# Altium schematic sheet BATTERY_GESTION.SchDoc: DARKYDEN_BATTERY_GESTION (part 2 of 3)
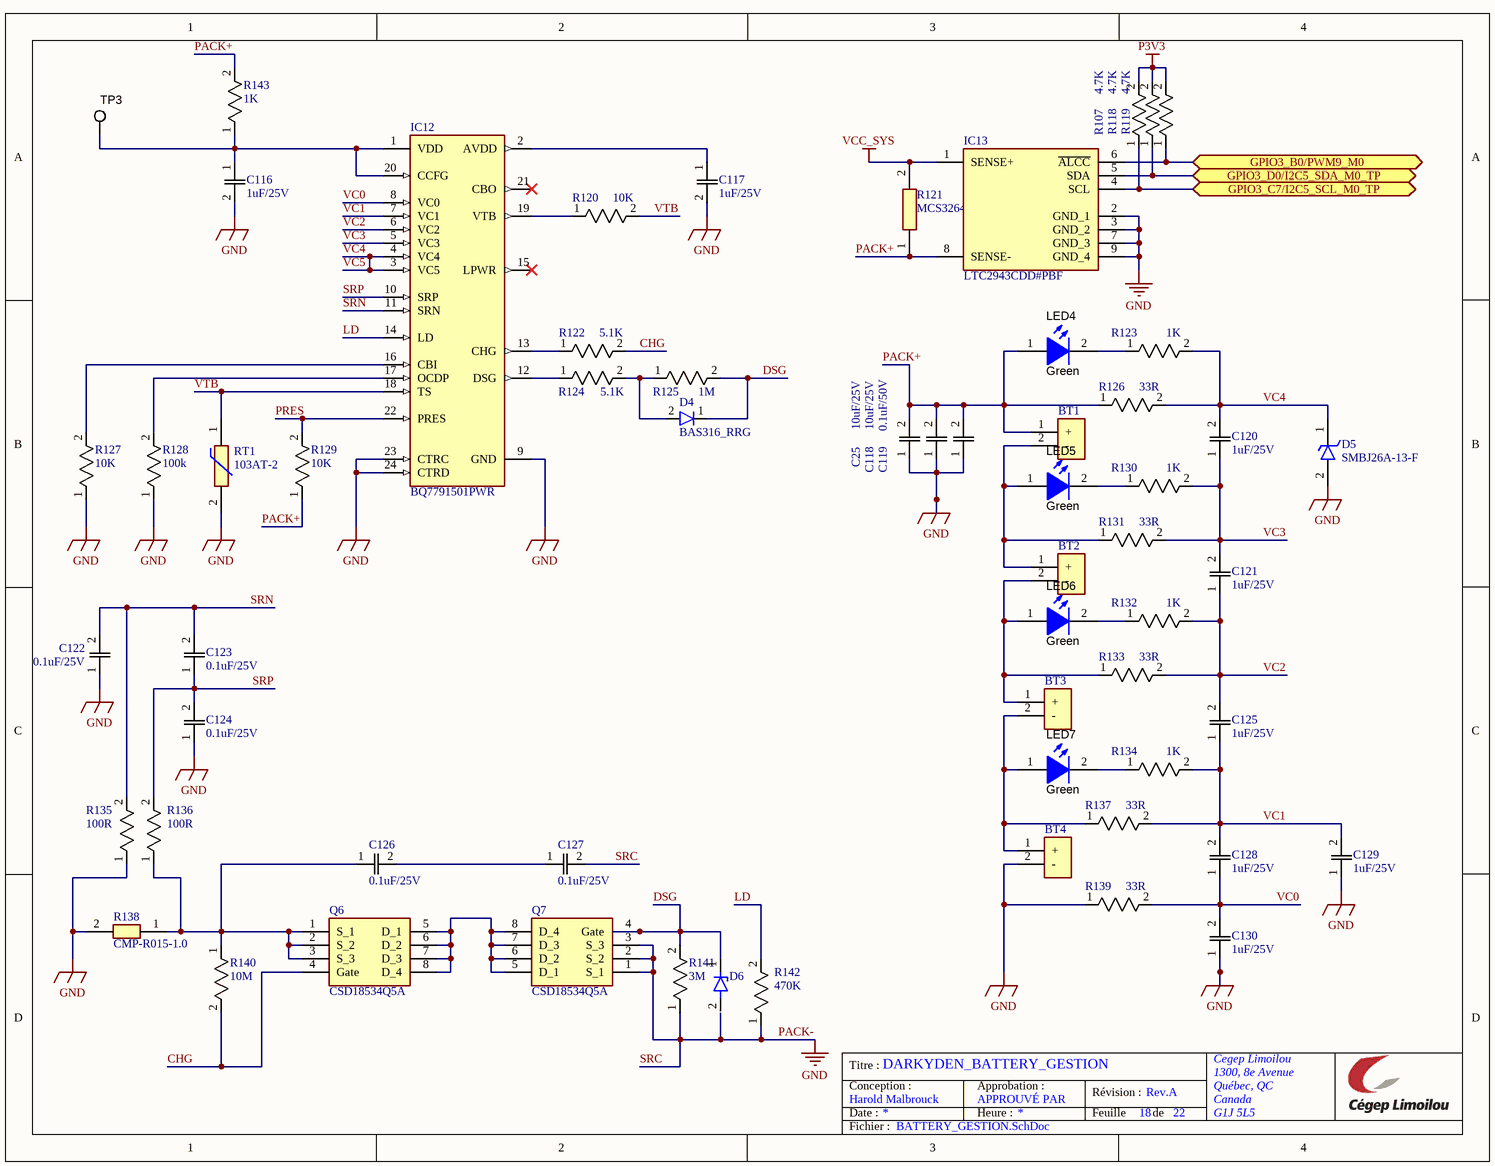
[diagram p1: BATTERY_GESTION.SchDoc]
## Library data of the parts
BT1-BT4 = Header 1.25MM: Connector; Manufacturer_Name: Molex; Datasheet Link: https://www.molex.com/pdm_docs/sd/530480210_sd.pdf; Height: 3.5mm; Manufacturer_Part_Number: 0530480210; Mouser Part Number: N/A; Mouser Price/Stock: https://www.mouser.co.uk/ProductDetail/Molex/0530480210?qs=PBcRNPEHKsoxSi7zGV6Ncw%3D%3D; Arrow Part Number: 0530480210; Arrow Price/Stock: https://www.arrow.com/en/products/0530480210/molex?utm_currency=USD&region=europe
C25 C118 = C0805C106K3PACTU: 10uF / 25 VDC, +85degC, X5R Dielec, +/-10% | KEMET C0805C106K3PACTU 0805; Dielectric Material: Ceramic; Material: 4241ConductorMaterial; Voltage Rating: 25V; Dissipation Factor: 10%; Mfr_Name: Kemet; Supplier: Digikey; Supplier Part Number: 399-11939-1-ND; Manufacturer: KEMET; Manufacturer Part Number: C0805C106K3PACTU; RoHS: Yes; Category: Ceramic Capacitors; Case/Package: 0805; Case Code (Metric): 2012; Case Code (Imperial): 0805; Min Operating Temperature: -55°C; Max Operating Temperature: 85°C; Dielectric: X5R; Packaging: Cut Tape; Voltage: 25V; Termination: Solder; Tolerance: 10%; Value: 10uF; Series: SMD Comm X5R; Voltage Rating (DC): 25V; Length: 2mm; Height: 1.25mm; Depth: 1.25mm; Reach SVHC Compliant: No; RoHS Compliant: Yes; Lead Free: 5697LeadFree; ComponentLink1URL: http://www.farnell.com/datasheets/2741185.pdf?src-supplier=Farnell; ComponentLink1Description: http://www.farnell.com/datasheets/2741185.pdf?src-supplier=Farnell; ComponentLink2URL: http://www.alliedelec.com/m/d/f3c02ddb98afa3dd1adcb801109671e9.pdf?src-supplier=Allied+Electronics; ComponentLink2Description: http://www.alliedelec.com/m/d/f3c02ddb98afa3dd1adcb801109671e9.pdf?src-supplier=Allied+Electronics; ComponentLink3URL: https://api.kemet.com/component-edge/download/datasheet/C0805C106K3PAC7800.pdf?src-supplier=Digikey; ComponentLink3Description: https://api.kemet.com/component-edge/download/datasheet/C0805C106K3PAC7800.pdf?src-supplier=Digikey; ComponentLink4URL: http://www.kemet.com/Lists/ProductCatalog/Attachments/19/KEM_C1006_X5R_SMD.pdf?src-supplier=Avnet; ComponentLink4Description: http://www.kemet.com/Lists/ProductCatalog/Attachments/19/KEM_C1006_X5R_SMD.pdf?src-supplier=Avnet; ComponentLink5URL: http://www.farnell.com/datasheets/2741185.pdf?src-supplier=Element14; ComponentLink5Description: http://www.farnell.com/datasheets/2741185.pdf?src-supplier=Element14; ComponentLink6URL: http://www.farnell.com/datasheets/2741185.pdf?src-supplier=Newark; ComponentLink6Description: http://www.farnell.com/datasheets/2741185.pdf?src-supplier=Newark; ComponentLink7URL: https://datasheet.octopart.com/C0805C106K3PACTU-Kemet-datasheet-46909776.pdf?src-supplier=Element14; ComponentLink7Description: https://datasheet.octopart.com/C0805C106K3PACTU-Kemet-datasheet-46909776.pdf?src-supplier=Element14
C116 C117 C120 C121 C125 C128-C130 = C0805C105K3RACTU: Ceramic capacitor, 1 µF, 25 V (DC), ±10 %, SMD 0805, X7R, C0805C105K3RAC7800; Manufacturer_Name: KEMET; Material: 4241ConductorMaterial; Value: 1uF; Tolerance: 10%; Voltage: 25V; Datasheet Link: https://content.kemet.com/datasheets/KEM_C1002_X7R_SMD.pdf; Height: 1.1mm; Manufacturer_Part_Number: C0805C105K3RACTU; Mouser Part Number: 80-C0805C105K3R; Mouser Price/Stock: https://www.mouser.co.uk/ProductDetail/KEMET/C0805C105K3RACTU?qs=7V%2FSUxyM1Kfm2X%2FN09twSA%3D%3D; Arrow Part Number: C0805C105K3RACTU; Arrow Price/Stock: https://www.arrow.com/en/products/c0805c105k3ractu/kemet-corporation?region=nac; Supplier: Digikey; Supplier Part Number: 399-C0805C105K3RACTUCT-ND; Manufacturer: KEMET; Manufacturer Part Number: C0805C105K3RACTU; RoHS: Yes; Category: Ceramic Capacitors; Stock: 127373; Pricing: 1=0.61, 10=0.498, 100=0.376, 1000=0.30337 (USD); Mounting Technology: Surface Mount; Case/Package: 0805; Pins: 2; Dielectric Material: Ceramic; Case Code (Imperial): 0805; Case Code (Metric): 2012; Min Operating Temperature: -55°C; Max Operating Temperature: 125°C; Dielectric: X7R; Packaging: Tape and Reel; Termination: SMD/SMT; Package Quantity: 2500; Voltage Rating: 25V; Voltage Rating (DC): 25V; Series: C; Construction: Flat; Length: 2mm; Width: 0.049inch; Depth: 1.25mm; Thickness: 0.055inch; Radiation Hardening: No; Reach SVHC Compliant: No; RoHS Compliant: Yes
C119 = C0805C104K5RACTU: 0.1uF/50V X7R 10% 0805 Multilayer Ceramic Capacitors Mlcc Smd/Smt Rohs; Manufacturer_Name: KEMET; Material: 4241ConductorMaterial; Value: 100nF; Voltage Rating: 50V; Voltage: 500V; Temperature Coefficient: 30ppm/°C; Datasheet Link: https://content.kemet.com/datasheets/KEM_C1002_X7R_SMD.pdf; Height: 1.1mm; Manufacturer_Part_Number: C0805C104K5RACTU; Mouser Part Number: 80-C0805C104K5R; Mouser Price/Stock: https://www.mouser.co.uk/ProductDetail/KEMET/C0805C104K5RACTU?qs=Pc30aiB8zWUISNb2Qeyxfw%3D%3D; Arrow Part Number: C0805C104K5RACTU; Arrow Price/Stock: https://www.arrow.com/en/products/c0805c104k5ractu/kemet-corporation?utm_currency=USD&region=nac; Supplier: Digikey; Supplier Part Number: 399-C0805C104K5RACTUCT-ND; Manufacturer: KEMET; Manufacturer Part Number: C0805C104K5RACTU; RoHS: Yes; Category: Ceramic Capacitors; Stock: 625118; Pricing: 1=0.09, 10=0.037, 100=0.0248, 1000=0.0224 (USD); Mounting Technology: Surface Mount,PCB; Case/Package: 0805; Pins: 2; Case Code (Imperial): 0805; Case Code (Metric): 2012; Min Operating Temperature: -55°C; Max Operating Temperature: 125°C; Package Quantity: 4000; Tolerance: 10%; Packaging: Tape and Reel; Voltage Rating (DC): 50V; Dielectric: X7R; Termination: SMD/SMT; Series: SMD Comm X7R; Construction: Flat; Length: 2mm; Width: 1.2mm; Lead Pitch: 0.75mm; Depth: 1.25mm; Radiation Hardening: No; Reach SVHC Compliant: No; RoHS Compliant: Yes; Lead Free: 5697LeadFree; ComponentLink1URL: https://datasheet.ciiva.com/32431/slceramic-chip-condensers-e-32431755.pdf?src-supplier=Distrelec; ComponentLink1Description: https://datasheet.ciiva.com/32431/slceramic-chip-condensers-e-32431755.pdf?src-supplier=Distrelec; ComponentLink2URL: https://datasheet.ciiva.com/28682/1851736-28682232.pdf?src-supplier=Element14; ComponentLink2Description: https://datasheet.ciiva.com/28682/1851736-28682232.pdf?src-supplier=Element14; ComponentLink3URL: https://datasheet.ciiva.com/18410/70095383-18410815.pdf?src-supplier=Allied+Electronics; ComponentLink3Description: https://datasheet.ciiva.com/18410/70095383-18410815.pdf?src-supplier=Allied+Electronics; ComponentLink4URL: https://datasheet.ciiva.com/14589/70095383-14589048.pdf?src-supplier=Allied+Electronics; ComponentLink4Description: https://datasheet.ciiva.com/14589/70095383-14589048.pdf?src-supplier=Allied+Electronics
C122-C124 C126 C127 = C0805C104K3RACTU: 0.1uF 25V X7R 10% SMD 0805 125C Plastic T/R; Mfr_Name: Kemet; Material: 4241ConductorMaterial; Value: 100nF; Temperature Coefficient: 30ppm/°C; Supplier: Digikey; Supplier Part Number: 399-C0805C104K3RACTUCT-ND; Manufacturer: KEMET; Manufacturer Part Number: C0805C104K3RACTU; RoHS: Yes; Category: Ceramic Capacitors; Mounting Technology: Surface Mount,PCB; Case/Package: 0805; Pins: 2NUMBER; Case Code (Imperial): 0805; Case Code (Metric): 2012; Min Operating Temperature: -55°C; Max Operating Temperature: 125°C; Packaging: Tape and Reel; Tolerance: 10%; Dielectric: X7R; Termination: SMD/SMT; Package Quantity: 4000; Voltage Rating: 25V; Series: SMD Comm X7R; Voltage Rating (DC): 25V; Construction: Flat; Length: 2mm; Width: 1.2mm; Height: 0.9mm; Depth: 1.25mm; Lead Pitch: 0.75mm; Thickness: 889um; Radiation Hardening: No; RoHS Compliant: Yes; Lead Free: 5697LeadFree; Reach SVHC Compliant: 4186SVHC; ComponentLink1URL: https://datasheet.ciiva.com/7842/kem-c1002-x7r-smd-7842536.pdf?src-supplier=Element14; ComponentLink1Description: https://datasheet.ciiva.com/7842/kem-c1002-x7r-smd-7842536.pdf?src-supplier=Element14; ComponentLink2URL: https://datasheet.ciiva.com/7842/kem-c1002-x7r-smd-7842538.pdf?src-supplier=Element14; ComponentLink2Description: https://datasheet.ciiva.com/7842/kem-c1002-x7r-smd-7842538.pdf?src-supplier=Element14
D4 = BAS316_RRG: Rectifier Diode Small Signal Switching 0.25A 4ns 2-Pin SOD-323 T/R; Manufacturer_Name: Taiwan Semiconductor; Manufacturer_Part_Number: BAS316 RRG; Max Reverse Voltage (DC): 100V; Average Rectified Current: 250mA; Datasheet Link: https://www.taiwansemi.com/assets/uploads/datasheet/BAS316_E1907.pdf; Height: 1.1mm; Mouser Part Number: 821-BAS316RRG; Mouser Price/Stock: https://www.mouser.co.uk/ProductDetail/Taiwan-Semiconductor/BAS316-RRG?qs=KwaGCOX4wIaA8PMRTc7F4Q%3D%3D; Arrow Part Number: BAS316 RRG; Arrow Price/Stock: https://www.arrow.com/en/products/bas316rrg/taiwan-semiconductor?region=europe; Supplier: Digikey; Supplier Part Number: BAS316RRGCT-ND; Manufacturer: Taiwan Semiconductor; Manufacturer Part Number: BAS316 RRG; RoHS: Yes; Category: Diodes; Stock: 41621; Pricing: 1=0.11, 10=0.081, 100=0.0564, 500=0.04008, 1000=0.03198 (USD); Mounting Technology: Surface Mount; Series: -; Packaging: Cut Tape; Reverse Recovery Time: 4ns; RoHS Compliant: Yes; ComponentLink1URL: https://www.taiwansemi.com/assets/uploads/datasheet/BAS316_E1907.pdf?src-supplier=Digikey; ComponentLink1Description: https://www.taiwansemi.com/assets/uploads/datasheet/BAS316_E1907.pdf?src-supplier=Digikey; ComponentLink2URL: https://datasheet.octopart.com/BAS316-RRG-Taiwan-Semiconductor-datasheet-166558704.pdf?src-supplier=Future+Electronics; ComponentLink2Description: https://datasheet.octopart.com/BAS316-RRG-Taiwan-Semiconductor-datasheet-166558704.pdf?src-supplier=Future+Electronics
D5 = SMBJ26A-13-F: TVS DIODE 26VWM 42.1VC SMB; Manufacturer_Name: Diodes Incorporated; Datasheet Link: https://www.diodes.com/assets/Datasheets/ds19002.pdf; Height: 2.5mm; Manufacturer_Part_Number: SMBJ26A-13-F; Mouser Part Number: 621-SMBJ26A-13-F; Mouser Price/Stock: https://www.mouser.co.uk/ProductDetail/Diodes-Incorporated/SMBJ26A-13-F?qs=gaDBXWSqsDCR7oWfjun1vA%3D%3D; Arrow Part Number: SMBJ26A-13-F; Arrow Price/Stock: https://www.arrow.com/en/products/smbj26a-13-f/diodes-incorporated?region=nac
D6 = MMSZ5248B-7-F: Zener Diode 18 V 500 mW ±5% Surface Mount SOD-123; Manufacturer_Name: Multicomp Pro; Datasheet Link: https://componentsearchengine.com/Datasheets/2/MMSZ5248B-7-F.pdf; Height: 1.15mm; Manufacturer_Part_Number: MMSZ5248B-7-F
IC12 = BQ7791501PWR: /Polymer 3~5 TSSOP-24 Battery Management ICs ROHS; Manufacturer_Name: Texas Instruments; Fault Protection: Over Current,Over Temperature,Short Circuit,Over/Under Voltage; Max Supply Voltage: 25V; Min Supply Voltage: 3V; Number of Cells: 5; Number of Outputs: 1; Output Voltage: 16V; Datasheet Link: https://www.ti.com/lit/gpn/BQ77915; Height: 1.2mm; Manufacturer_Part_Number: BQ7791501PWR; Mouser Part Number: 595-BQ7791501PWR; Mouser Price/Stock: https://www.mouser.co.uk/ProductDetail/Texas-Instruments/BQ7791501PWR?qs=B6kkDfuK7%2FBYqAWOM%2FFUaQ%3D%3D; Arrow Part Number: BQ7791501PWR; Arrow Price/Stock: null?region=nac; Supplier: Digikey; Supplier Part Number: 296-BQ7791501PWRCT-ND; Manufacturer: Texas Instruments; Manufacturer Part Number: BQ7791501PWR; RoHS: Yes; Category: Battery Management; Stock: 5538; Pricing: 1=1.62, 10=1.183, 25=1.0748, 100=0.9555, 250=0.89868, 500=0.86442, 1000=0.83623 (USD); Mounting Technology: Surface Mount; Case/Package: TSSOP; Pins: 24; Min Operating Temperature: -40°C; Max Operating Temperature: 85°C; Series: -; Length: 7.8mm; Width: 4.4mm; Thickness: 1mm; ComponentLink1URL: http://www.ti.com/general/docs/suppproductinfo.tsp?distId=10&amp;gotoUrl=http%3A%2F%2Fwww.ti.com%2Flit%2Fgpn%2Fbq77915&src-supplier=Digikey; ComponentLink1Description: http://www.ti.com/general/docs/suppproductinfo.tsp?distId=10&amp;gotoUrl=http%3A%2F%2Fwww.ti.com%2Flit%2Fgpn%2Fbq77915&src-supplier=Digikey
IC13 = LTC2943CDD#PBF: LTC2943 - Multicell Battery Gas Gauge with Temperature, Voltage and Current Measurement; Manufacturer_Name: Analog Devices; Manufacturer: Analog Devices / Linear Technology; Min Supply Voltage: 3.6V; Max Supply Voltage: 20V; Interface: I2C,SMBus; Battery Type: UNIVERSAL; Nominal Supply Current: 650uA; Datasheet Link: https://www.analog.com/media/en/technical-documentation/data-sheets/2943fa.pdf; Height: 0.8mm; Manufacturer_Part_Number: LTC2943CDD#PBF; Mouser Part Number: 584-LTC2943CDD#PBF; Mouser Price/Stock: https://www.mouser.co.uk/ProductDetail/Analog-Devices/LTC2943CDDPBF?qs=hVkxg5c3xu%2FXIG8gAJxzFw%3D%3D; Arrow Part Number: LTC2943CDD#PBF; Arrow Price/Stock: https://www.arrow.com/en/products/ltc2943cddpbf/analog-devices?utm_currency=USD&region=nac; Supplier: Digikey; Supplier Part Number: 505-LTC2943CDD#PBF-ND; Manufacturer Part Number: LTC2943CDD#PBF; RoHS: Yes; Category: Battery Management; Stock: 11003; Pricing: 1=7.04, 10=4.723, 25=4.1192, 121=3.55 (USD); Mounting Technology: Surface Mount; Case/Package: DFN; Pins: 8; Min Operating Temperature: 0°C; Max Operating Temperature: 70°C; Packaging: Rail/Tube; Series: -; Reach SVHC Compliant: No; RoHS Compliant: Yes; ComponentLink1URL: https://datasheet.ciiva.com/28383/1831515-28383394.pdf?src-supplier=Element14; ComponentLink1Description: https://datasheet.ciiva.com/28383/1831515-28383394.pdf?src-supplier=Element14; ComponentLink2URL: https://datasheet.ciiva.com/23944/1765916-23944624.pdf?src-supplier=Newark; ComponentLink2Description: https://datasheet.ciiva.com/23944/1765916-23944624.pdf?src-supplier=Newark; ComponentLink3URL: https://datasheet.ciiva.com/29610/44018-29610085.pdf?src-supplier=Digikey; ComponentLink3Description: https://datasheet.ciiva.com/29610/44018-29610085.pdf?src-supplier=Digikey; ComponentLink4URL: https://datasheet.ciiva.com/31395/1831515-31395594.pdf?src-supplier=Farnell; ComponentLink4Description: https://datasheet.ciiva.com/31395/1831515-31395594.pdf?src-supplier=Farnell
LED4-LED7 = LED_Gr_SMD: LED, Green, SMD; Manufacturer: Lite-On; Vf_V: 2.1V; Io_A: 20mA; Power_TotalModule: 100mW; Value1: 0.1W; CompType: LED; PartNumber: LTST-C190GKT; MountType: SMT; RoHS: Y; PackageReference: 1.6x0.8x0.8mm; Type: ?; Value2: 2.1V; Color: green; ComponentLink1URL: https://sps06.itg.ti.com/sites/KMS/crossdivteams/altium/docs/ComponentDatasheets/LTST-C190GKT.pdf; ComponentLink1Description: Datasheet link
Q6 Q7 = CSD18534Q5A: MOSFET N-Channel 60 V 13A (Ta), 50A (Tc) 3.1W (Ta), 77W (Tc) Surface Mount 8-VSONP (5x6); Manufacturer_Name: Texas Instruments; Datasheet Link: http://www.ti.com/lit/gpn/csd18534q5a; Manufacturer_Part_Number: CSD18534Q5A; Mouser Part Number: 595-CSD18534Q5A; Mouser Price/Stock: https://www.mouser.co.uk/ProductDetail/Texas-Instruments/CSD18534Q5A?qs=9Zb5cNRUa0ZPNHf4ZXtqIA%3D%3D; Arrow Part Number: CSD18534Q5A; Arrow Price/Stock: https://www.arrow.com/en/products/csd18534q5a/texas-instruments?utm_currency=USD&region=nac
R107 R118 R119 = ERA-3AEB472V: Res Thin Film 0603 4.7K Ohm 0.1% 0.1W ±25ppm/°C Molded SMD Punched Carrier T/R; Mfr_Name: Panasonic; Voltage Rating: 75V; Value: 4.7kR; Power Rating: 100mW; Supplier: Digikey; Supplier Part Number: P4.7KDBCT-ND; Manufacturer: Panasonic; Manufacturer Part Number: ERA-3AEB472V; RoHS: Yes; Category: Chip SMD Resistors; Stock: 284751; Pricing: 1=0.1, 10=0.065, 50=0.0574, 100=0.0541, 500=0.0475, 1000=0.045 (USD); Mounting Technology: Surface Mount; Case/Package: 0603; Pins: 2; Contact Plating: Tin; Case Code (Metric): 1608; Case Code (Imperial): 0603; Min Operating Temperature: -55°C; Max Operating Temperature: 155°C; Packaging: Tape and Reel; Package Quantity: 5000; Termination: SMD/SMT; Series: ERA-3A; Tolerance: 0.1%; Resistor Type: Thin Film; Number of Terminations: 2; Temperature Coefficient: 25ppm/°C; Max Power Dissipation: 100mW; Voltage Rating (DC): 75V; Working Voltage: 75V; Construction: Rectangular; Resistance Tolerance: 0.1%; Technology: THIN FILM; Features: Automotive AEC-Q200; Length: 1.6mm; Width: 0.8mm; Height: 0.45mm; Depth: 0.8mm; Ratings: AEC-Q200; Radiation Hardening: No; Reach SVHC Compliant: No; RoHS Compliant: Yes; Military Standard: Not; Lead Free: Lead Free; ComponentLink1URL: https://datasheet.ciiva.com/11808/0900766b80fe20f7-11808039.pdf?src-supplier=Rs; ComponentLink1Description: https://datasheet.ciiva.com/11808/0900766b80fe20f7-11808039.pdf?src-supplier=Rs; ComponentLink2URL: https://datasheet.ciiva.com/29183/451124-da-01-en-widerstand-0603-era-29183789.pdf?src-supplier=Conrad; ComponentLink2Description: https://datasheet.ciiva.com/29183/451124-da-01-en-widerstand-0603-era-29183789.pdf?src-supplier=Conrad; ComponentLink3URL: https://datasheet.ciiva.com/22781/485442-22781497.pdf?src-supplier=Farnell; ComponentLink3Description: https://datasheet.ciiva.com/22781/485442-22781497.pdf?src-supplier=Farnell; ComponentLink4URL: https://datasheet.ciiva.com/43455/485442-43455227.pdf?src-supplier=Farnell; ComponentLink4Description: https://datasheet.ciiva.com/43455/485442-43455227.pdf?src-supplier=Farnell; ComponentLink5URL: https://datasheet.ciiva.com/9116/aoa0000ce26-9116681.pdf?src-supplier=Avnet; ComponentLink5Description: https://datasheet.ciiva.com/9116/aoa0000ce26-9116681.pdf?src-supplier=Avnet; ComponentLink6URL: https://datasheet.ciiva.com/9117/aoa0000ce26-9117707.pdf?src-supplier=Avnet; ComponentLink6Description: https://datasheet.ciiva.com/9117/aoa0000ce26-9117707.pdf?src-supplier=Avnet; ComponentLink7URL: https://datasheet.ciiva.com/48425/era-eng-tds-48425470.pdf?src-supplier=Distrelec; ComponentLink7Description: https://datasheet.ciiva.com/48425/era-eng-tds-48425470.pdf?src-supplier=Distrelec; ComponentLink8URL: https://datasheet.ciiva.com/46422/485442-46422693.pdf?src-supplier=Element14; ComponentLink8Description: https://datasheet.ciiva.com/46422/485442-46422693.pdf?src-supplier=Element14; ComponentLink9URL: https://datasheet.ciiva.com/30078/54aoa0000ce26-30078815.pdf?src-supplier=Onlinecomponents.com; ComponentLink9Description: https://datasheet.ciiva.com/30078/54aoa0000ce26-30078815.pdf?src-supplier=Onlinecomponents.com; ComponentLink10URL: https://datasheet.ciiva.com/22743/485442-22743061.pdf?src-supplier=Element14; ComponentLink10Description: https://datasheet.ciiva.com/22743/485442-22743061.pdf?src-supplier=Element14
R120 R127 R129 = ERJ-3GEYJ103V: 10K Ohm 5% Res Thick Film 0603  0.1W(1/10W) ±200ppm/C Pad SMD Automotive T/R; Manufacturer_Name: Panasonic; Value: 10kR; Temperature Coefficient: 200ppm/°C; Power Rating: 100mW; Voltage Rating: 75V; Datasheet Link: http://docs-europe.electrocomponents.com/webdocs/13ba/0900766b813ba21b.pdf; Height: 0.55mm; Manufacturer_Part_Number: ERJ-3GEYJ103V; Mouser Part Number: 667-ERJ-3GEYJ103V; Mouser Price/Stock: https://www.mouser.co.uk/ProductDetail/Panasonic/ERJ-3GEYJ103V?qs=66DK8nO8gJBWgc%252B0VNNxzg%3D%3D; Arrow Part Number: ERJ-3GEYJ103V; Arrow Price/Stock: https://www.arrow.com/en/products/erj-3geyj103v/panasonic?region=europe; Supplier: Digikey; Supplier Part Number: P10KGCT-ND; Manufacturer: Panasonic; Manufacturer Part Number: ERJ-3GEYJ103V; RoHS: Yes; Category: Chip SMD Resistors; Stock: 2191587; Pricing: 1=0.1, 10=0.033, 50=0.02, 100=0.0165, 500=0.01096, 1000=0.00939 (USD); Mounting Technology: Surface Mount; Case/Package: 0603; Case Code (Imperial): 0603; Case Code (Metric): 1608; Weight: 7.1E-05oz; Contact Plating: Tin; Min Operating Temperature: -55°C; Max Operating Temperature: 155°C; Tolerance: 5%; Packaging: Tape and Reel; Technology: THICK FILM; Package Quantity: 1; Resistor Type: Thick Film; Termination: SMD/SMT; Number of Terminations: 2; Max Power Dissipation: 100mW; Working Voltage: 75V; Features: Automotive AEC-Q200; Series: ERJ; Construction: Rectangular; Resistance Tolerance: 5%; Length: 1.6mm; Width: 0.8mm; Depth: 0.8mm; Reach SVHC Compliant: No; Military Standard: Not; Lead Free: Lead Free; RoHS Compliant: Yes; ComponentLink1URL: https://datasheet.ciiva.com/11809/0900766b80f806dd-11809566.pdf?src-supplier=Rs; ComponentLink1Description: https://datasheet.ciiva.com/11809/0900766b80f806dd-11809566.pdf?src-supplier=Rs; ComponentLink2URL: https://datasheet.ciiva.com/34303/2007265-34303757.pdf?src-supplier=Jameco; ComponentLink2Description: https://datasheet.ciiva.com/34303/2007265-34303757.pdf?src-supplier=Jameco; ComponentLink3URL: https://datasheet.ciiva.com/48531/aoa0000ce1-48531887.pdf?src-supplier=Avnet; ComponentLink3Description: https://datasheet.ciiva.com/48531/aoa0000ce1-48531887.pdf?src-supplier=Avnet; ComponentLink4URL: https://datasheet.ciiva.com/9117/aoa0000ce1-9117038.pdf?src-supplier=Avnet; ComponentLink4Description: https://datasheet.ciiva.com/9117/aoa0000ce1-9117038.pdf?src-supplier=Avnet; ComponentLink5URL: https://datasheet.ciiva.com/28514/1678796-28514213.pdf?src-supplier=Element14; ComponentLink5Description: https://datasheet.ciiva.com/28514/1678796-28514213.pdf?src-supplier=Element14; ComponentLink6URL: https://datasheet.ciiva.com/46371/1678796-46371909.pdf?src-supplier=Element14; ComponentLink6Description: https://datasheet.ciiva.com/46371/1678796-46371909.pdf?src-supplier=Element14; ComponentLink7URL: https://datasheet.ciiva.com/46385/1678796-46385240.pdf?src-supplier=Element14; ComponentLink7Description: https://datasheet.ciiva.com/46385/1678796-46385240.pdf?src-supplier=Element14; ComponentLink8URL: https://datasheet.ciiva.com/24133/aoa0000ce1-37422-24133064.pdf?src-supplier=Mouser; ComponentLink8Description: https://datasheet.ciiva.com/24133/aoa0000ce1-37422-24133064.pdf?src-supplier=Mouser; ComponentLink9URL: https://datasheet.ciiva.com/16740/aoa0000ce1-16740655.pdf?src-supplier=Future+Electronics; ComponentLink9Description: https://datasheet.ciiva.com/16740/aoa0000ce1-16740655.pdf?src-supplier=Future+Electronics; ComponentLink10URL: https://datasheet.ciiva.com/30147/4aoa0000ce1-30147029.pdf?src-supplier=Onlinecomponents.com; ComponentLink10Description: https://datasheet.ciiva.com/30147/4aoa0000ce1-30147029.pdf?src-supplier=Onlinecomponents.com
R121 = MCS3264R010FER: Res Metal Alloy 2512 0.01 Ohm 1% 2W 50ppm/ C Molded SMD T/R; Manufacturer_Name: Ohmite; Value: 10mR; Voltage Rating: 220mV; Temperature Coefficient: 50ppm/°C; Datasheet Link: https://componentsearchengine.com/Datasheets/2/MCS3264R010FER.pdf; Height: 0.62mm; Manufacturer_Part_Number: MCS3264R010FER; Mouser Part Number: 588-MCS3264R010FER; Mouser Price/Stock: https://www.mouser.co.uk/ProductDetail/Ohmite/MCS3264R010FER?qs=SvApV4JM6f2MfSPuOPYXkg%3D%3D; Supplier: Digikey; Supplier Part Number: MCS3264R010FERCT-ND; Manufacturer: Ohmite; Manufacturer Part Number: MCS3264R010FER; RoHS: Yes; Category: Chip SMD Resistors; Stock: 27552; Pricing: 1=0.83, 10=0.538, 25=0.4588, 50=0.4092, 100=0.367, 250=0.32076, 500=0.29178, 1000=0.26717 (USD); Mounting Technology: Surface Mount; Case/Package: 2512; Pins: 2; Case Code (Metric): 3264; Case Code (Imperial): 1225; Min Operating Temperature: -25°C; Max Operating Temperature: 150°C; Package Quantity: 1; Power Rating: 2W; Tolerance: 1%; Packaging: Tape and Reel; Resistor Type: Metal Film,Metal Alloy; Number of Terminations: 2; Termination: SMD/SMT; Max Power Dissipation: 2W; Features: Flame Retardant Coating; Series: MCS; Resistance Tolerance: 1%; Technology: METAL ALLOY; Construction: Rectangular; Length: 6.4mm; Width: 3.2mm; Depth: 3.2mm; Military Standard: Not; RoHS Compliant: Yes; Reach SVHC Compliant: Unknown; ComponentLink1URL: https://datasheet.ciiva.com/2482/res-mcs-2482064.pdf?src-supplier=Digikey; ComponentLink1Description: https://datasheet.ciiva.com/2482/res-mcs-2482064.pdf?src-supplier=Digikey; ComponentLink2URL: https://datasheet.ciiva.com/2482/res-mcs-2482065.pdf?src-supplier=Digikey; ComponentLink2Description: https://datasheet.ciiva.com/2482/res-mcs-2482065.pdf?src-supplier=Digikey; ComponentLink3URL: https://datasheet.ciiva.com/2482/res-mcs-2482063.pdf?src-supplier=Digikey; ComponentLink3Description: https://datasheet.ciiva.com/2482/res-mcs-2482063.pdf?src-supplier=Digikey; ComponentLink4URL: https://datasheet.ciiva.com/46391/1807944-46391575.pdf?src-supplier=Element14; ComponentLink4Description: https://datasheet.ciiva.com/46391/1807944-46391575.pdf?src-supplier=Element14; ComponentLink5URL: https://datasheet.ciiva.com/7715/mcs-7715862.pdf?src-supplier=Element14; ComponentLink5Description: https://datasheet.ciiva.com/7715/mcs-7715862.pdf?src-supplier=Element14; ComponentLink6URL: https://datasheet.ciiva.com/5970/mcs-5970876.pdf?src-supplier=Farnell; ComponentLink6Description: https://datasheet.ciiva.com/5970/mcs-5970876.pdf?src-supplier=Farnell; ComponentLink7URL: https://datasheet.ciiva.com/5468/mcs-14321-5468876.pdf?src-supplier=Mouser; ComponentLink7Description: https://datasheet.ciiva.com/5468/mcs-14321-5468876.pdf?src-supplier=Mouser; ComponentLink8URL: https://datasheet.ciiva.com/28655/1842857-28655687.pdf?src-supplier=Element14; ComponentLink8Description: https://datasheet.ciiva.com/28655/1842857-28655687.pdf?src-supplier=Element14; ComponentLink9URL: https://datasheet.ciiva.com/16786/70024315-16786781.pdf?src-supplier=Allied+Electronics; ComponentLink9Description: https://datasheet.ciiva.com/16786/70024315-16786781.pdf?src-supplier=Allied+Electronics
R122 R124 = ERA-3ARW512V: 5.1K Ohm 0.05% 0.1W ±10ppm/°C Molded Res Thin Film 0603 SMD Punched Carrier T/R; Manufacturer_Name: Panasonic; Value: 5.1kR; Power Rating: 100mW; Voltage Rating: 75V; Datasheet Link: https://industrial.panasonic.com/cdbs/www-data/pdf/RDM0000/AOA0000C307.pdf; Height: 0.55mm; Manufacturer_Part_Number: ERA-3ARW512V; Mouser Part Number: 667-ERA-3ARW512V; Mouser Price/Stock: https://www.mouser.co.uk/ProductDetail/Panasonic/ERA-3ARW512V?qs=ob%252BdNz2%252BYEinU%2F%252BGAvZ4EA%3D%3D; Supplier: Digikey; Supplier Part Number: P5.1KBECT-ND; Manufacturer: Panasonic; Manufacturer Part Number: ERA-3ARW512V; RoHS: Yes; Category: Chip SMD Resistors; Stock: 12588; Pricing: 1=0.47, 10=0.394, 50=0.345, 100=0.3263, 500=0.28562, 1000=0.2461 (USD); Mounting Technology: Surface Mount; Case/Package: 0603; Case Code (Metric): 1608; Case Code (Imperial): 0603; Weight: 7.1E-05oz; Contact Plating: Tin; Min Operating Temperature: -55°C; Max Operating Temperature: 155°C; Tolerance: 0.05%; Packaging: Tape and Reel; Package Quantity: 1; Number of Terminations: 2; Termination: SMD/SMT; Temperature Coefficient: 10ppm/°C; Max Power Dissipation: 100mW; Features: Automotive AEC-Q200; Series: ERA-3A; Technology: METAL FILM; Voltage Rating (DC): 75V; Length: 1.6mm; Width: 0.8mm; Depth: 0.8mm; Lead Free: Lead Free; RoHS Compliant: Yes; ComponentLink1URL: https://media.digikey.com/pdf/Data%20Sheets/Panasonic%20Resistors%20Thermistors%20PDFs/ERA_Series_LE.pdf?src-supplier=Digikey; ComponentLink1Description: https://media.digikey.com/pdf/Data%20Sheets/Panasonic%20Resistors%20Thermistors%20PDFs/ERA_Series_LE.pdf?src-supplier=Digikey; ComponentLink2URL: http://www.onlinecomponents.com/datasheet/era-3arw512v.aspx?p=44480300&src-supplier=Onlinecomponents.com; ComponentLink2Description: http://www.onlinecomponents.com/datasheet/era-3arw512v.aspx?p=44480300&src-supplier=Onlinecomponents.com; ComponentLink3URL: http://www.alliedelec.com/m/d/b6b0537e86f421aa7f5975bb1d8f429a.pdf?src-supplier=Allied+Electronics; ComponentLink3Description: http://www.alliedelec.com/m/d/b6b0537e86f421aa7f5975bb1d8f429a.pdf?src-supplier=Allied+Electronics; ComponentLink4URL: http://uk.rs-online.com/webdocs/1440/0900766b814408ab.pdf?src-supplier=Rs; ComponentLink4Description: http://uk.rs-online.com/webdocs/1440/0900766b814408ab.pdf?src-supplier=Rs; ComponentLink5URL: http://www.mouser.com/ds/2/315/AOA0000C237-944224.pdf?src-supplier=Mouser; ComponentLink5Description: http://www.mouser.com/ds/2/315/AOA0000C237-944224.pdf?src-supplier=Mouser; ComponentLink6URL: https://industrial.panasonic.com/cdbs/www-data/pdf/RDM0000/AOA0000C307.pdf?src-supplier=Digikey; ComponentLink6Description: https://industrial.panasonic.com/cdbs/www-data/pdf/RDM0000/AOA0000C307.pdf?src-supplier=Digikey; ComponentLink7URL: http://industrial.panasonic.com/www-data/pdf/AOA0000/AOA0000CE26.pdf?src-supplier=Avnet; ComponentLink7Description: http://industrial.panasonic.com/www-data/pdf/AOA0000/AOA0000CE26.pdf?src-supplier=Avnet; ComponentLink8URL: https://datasheet.octopart.com/ERA-3ARW512V-Panasonic-datasheet-33006989.pdf?src-supplier=Electro+Sonic; ComponentLink8Description: https://datasheet.octopart.com/ERA-3ARW512V-Panasonic-datasheet-33006989.pdf?src-supplier=Electro+Sonic; ComponentLink9URL: https://datasheet.octopart.com/ERA-3ARW512V-Panasonic-datasheet-154766165.pdf?src-supplier=Master+Electronics; ComponentLink9Description: https://datasheet.octopart.com/ERA-3ARW512V-Panasonic-datasheet-154766165.pdf?src-supplier=Master+Electronics
R123 R130 R132 R134 R143 = ERJ-3EKF1001V: 1K Ohm 1% 1/10W Res Thick Film 0603 ±100ppm/°C Molded SMD Punched Carrier T/R; Manufacturer_Name: Panasonic; Value: 1kR; Power Rating: 100mW; Voltage Rating: 75V; Datasheet Link: http://industrial.panasonic.com/cdbs/www-data/pdf/RDA0000/AOA0000C86.pdf; Height: 0.55mm; Manufacturer_Part_Number: ERJ-3EKF1001V; Mouser Part Number: 667-ERJ-3EKF1001V; Mouser Price/Stock: https://www.mouser.co.uk/ProductDetail/Panasonic/ERJ-3EKF1001V?qs=H7k1u0Mp9JTM8yQxOuvoDg%3D%3D; Arrow Part Number: ERJ-3EKF1001V; Arrow Price/Stock: https://www.arrow.com/en/products/erj-3ekf1001v/panasonic?utm_currency=USD&region=europe; Supplier: Digikey; Supplier Part Number: P1.00KHCT-ND; Manufacturer: Panasonic; Manufacturer Part Number: ERJ-3EKF1001V; RoHS: Yes; Category: Chip SMD Resistors; Stock: 1610348; Pricing: 1=0.1, 10=0.035, 100=0.0177, 1000=0.01014, 2500=0.00847 (USD); Mounting Technology: Surface Mount; Case/Package: 0603; Pins: 2; Case Code (Metric): 1608; Case Code (Imperial): 0603; Contact Plating: Tin; Min Operating Temperature: -55°C; Max Operating Temperature: 155°C; Tolerance: 1%; Temperature Coefficient: 100ppm/°C; Packaging: Tape and Reel; Package Quantity: 5000; Resistor Type: Thick Film; Number of Terminations: 2; Termination: SMD/SMT; Max Power Dissipation: 100mW; Voltage Rating (DC): 75V; Features: Automotive AEC-Q200; Series: ERJ; Technology: THICK FILM; Construction: Rectangular; Resistance Tolerance: 1%; Length: 1.6mm; Width: 0.8mm; Depth: 0.8mm; Radiation Hardening: No; Reach SVHC Compliant: No; Military Standard: Not; RoHS Compliant: Yes; ComponentLink1URL: https://datasheet.ciiva.com/48530/aoa0000ce2-48530987.pdf?src-supplier=Avnet; ComponentLink1Description: https://datasheet.ciiva.com/48530/aoa0000ce2-48530987.pdf?src-supplier=Avnet; ComponentLink2URL: https://datasheet.ciiva.com/30063/aoa0000ce2-30063390.pdf?src-supplier=Onlinecomponents.com; ComponentLink2Description: https://datasheet.ciiva.com/30063/aoa0000ce2-30063390.pdf?src-supplier=Onlinecomponents.com; ComponentLink3URL: https://datasheet.ciiva.com/16449/aoa0000ce2-16449065.pdf?src-supplier=Future+Electronics; ComponentLink3Description: https://datasheet.ciiva.com/16449/aoa0000ce2-16449065.pdf?src-supplier=Future+Electronics; ComponentLink4URL: https://datasheet.ciiva.com/22673/1678782-22673918.pdf?src-supplier=Element14; ComponentLink4Description: https://datasheet.ciiva.com/22673/1678782-22673918.pdf?src-supplier=Element14; ComponentLink5URL: https://datasheet.ciiva.com/16768/70260748-16768437.pdf?src-supplier=Allied+Electronics; ComponentLink5Description: https://datasheet.ciiva.com/16768/70260748-16768437.pdf?src-supplier=Allied+Electronics; ComponentLink6URL: https://datasheet.ciiva.com/16774/70260748-16774550.pdf?src-supplier=Allied+Electronics; ComponentLink6Description: https://datasheet.ciiva.com/16774/70260748-16774550.pdf?src-supplier=Allied+Electronics; ComponentLink7URL: https://datasheet.ciiva.com/46373/1678782-46373339.pdf?src-supplier=Element14; ComponentLink7Description: https://datasheet.ciiva.com/46373/1678782-46373339.pdf?src-supplier=Element14; ComponentLink8URL: https://datasheet.ciiva.com/46373/1678782-46373340.pdf?src-supplier=Element14; ComponentLink8Description: https://datasheet.ciiva.com/46373/1678782-46373340.pdf?src-supplier=Element14; ComponentLink9URL: https://datasheet.ciiva.com/7942/aoa0000ce2-7942427.pdf?src-supplier=Element14; ComponentLink9Description: https://datasheet.ciiva.com/7942/aoa0000ce2-7942427.pdf?src-supplier=Element14; ComponentLink10URL: https://datasheet.ciiva.com/9198/aoa0000ce2-9198923.pdf?src-supplier=Avnet; ComponentLink10Description: https://datasheet.ciiva.com/9198/aoa0000ce2-9198923.pdf?src-supplier=Avnet; ComponentLink11URL: https://datasheet.ciiva.com/24070/aoa0000ce2-24070269.pdf?src-supplier=Mouser; ComponentLink11Description: https://datasheet.ciiva.com/24070/aoa0000ce2-24070269.pdf?src-supplier=Mouser
R125 = ERJ-3GEYJ105V: 1M Ohm Res Thick Film 0603 5% 0.1W(1/10W) +/-200ppm/ßC SMD Automotive T/R; Manufacturer_Name: Panasonic; Value: 1MR; Power Rating: 100mW; Voltage Rating: 75V; Temperature Coefficient: 200ppm/°C; Datasheet Link: http://docs-europe.electrocomponents.com/webdocs/13ba/0900766b813ba21b.pdf; Height: 0.55mm; Manufacturer_Part_Number: ERJ-3GEYJ105V; Mouser Part Number: 667-ERJ-3GEYJ105V; Mouser Price/Stock: https://www.mouser.co.uk/ProductDetail/Panasonic/ERJ-3GEYJ105V?qs=66DK8nO8gJAFuT6JGu2rQw%3D%3D; Arrow Part Number: ERJ-3GEYJ105V; Arrow Price/Stock: https://www.arrow.com/en/products/erj-3geyj105v/panasonic?region=nac; Supplier: Digikey; Supplier Part Number: P1.0MGCT-ND; Manufacturer: Panasonic; Manufacturer Part Number: ERJ-3GEYJ105V; RoHS: Yes; Category: Chip SMD Resistors; Stock: 339054; Pricing: 1=0.1, 10=0.033, 50=0.02, 100=0.0165, 500=0.01096, 1000=0.00939 (USD); Mounting Technology: Surface Mount; Case/Package: 0603; Case Code (Imperial): 0603; Case Code (Metric): 1608; Weight: 7.1E-05oz; Contact Plating: Tin; Min Operating Temperature: -55°C; Max Operating Temperature: 155°C; Packaging: Tape and Reel; Tolerance: 5%; Package Quantity: 1; Resistor Type: Thick Film; Termination: SMD/SMT; Number of Terminations: 2; Max Power Dissipation: 100mW; Features: Automotive AEC-Q200; Series: ERJ; Resistance Tolerance: 5%; Construction: Rectangular; Technology: THICK FILM; Length: 1.6mm; Width: 0.8mm; Depth: 0.8mm; Radiation Hardening: No; Military Standard: Not; Lead Free: Lead Free; RoHS Compliant: Yes; Reach SVHC Compliant: Unknown; ComponentLink1URL: https://datasheet.ciiva.com/11821/0900766b80f806dd-11821431.pdf?src-supplier=Rs; ComponentLink1Description: https://datasheet.ciiva.com/11821/0900766b80f806dd-11821431.pdf?src-supplier=Rs; ComponentLink2URL: https://datasheet.ciiva.com/24160/aoa0000ce1-37422-24160165.pdf?src-supplier=Mouser; ComponentLink2Description: https://datasheet.ciiva.com/24160/aoa0000ce1-37422-24160165.pdf?src-supplier=Mouser; ComponentLink3URL: https://datasheet.ciiva.com/9117/aoa0000ce1-9117049.pdf?src-supplier=Avnet; ComponentLink3Description: https://datasheet.ciiva.com/9117/aoa0000ce1-9117049.pdf?src-supplier=Avnet
R126 R131 R133 R137 R139 = ERJ-3EKF33R0V: Res Thick Film 0603 33 Ohm 1% 0.1W ±100ppm/°C Molded SMD Punched Carrier T/R; Mfr_Name: Panasonic; Power Rating: 100mW; Voltage Rating: 75V; Supplier: Digikey; Supplier Part Number: P33.0HCT-ND; Manufacturer: Panasonic; Manufacturer Part Number: ERJ-3EKF33R0V; RoHS: Yes; Category: Chip SMD Resistors; Stock: 430721; Pricing: 1=0.1, 10=0.035, 100=0.0177, 1000=0.01014, 2500=0.00888 (USD); Mounting Technology: Surface Mount; Case/Package: 0603; Pins: 2; Case Code (Metric): 1608; Case Code (Imperial): 0603; Contact Plating: Tin; Min Operating Temperature: -55°C; Max Operating Temperature: 155°C; Value: 33R; Tolerance: 1%; Packaging: Tape and Reel; Package Quantity: 1; Resistor Type: Thick Film; Number of Terminations: 2; Temperature Coefficient: 100ppm/°C; Termination: SMD/SMT; Max Power Dissipation: 100mW; Voltage Rating (DC): 75V; Features: Automotive AEC-Q200; Series: ERJ; Construction: Rectangular; Resistance Tolerance: 1%; Length: 1.6mm; Width: 0.8mm; Height: 0.022inch; Depth: 0.8mm; Radiation Hardening: No; Reach SVHC Compliant: No; Military Standard: Not; Lead Free: Lead Free; RoHS Compliant: Yes; ComponentLink1URL: https://datasheet.ciiva.com/5917/aoa0000ce2-5917831.pdf?src-supplier=Farnell; ComponentLink1Description: https://datasheet.ciiva.com/5917/aoa0000ce2-5917831.pdf?src-supplier=Farnell; ComponentLink2URL: https://datasheet.ciiva.com/48531/aoa0000ce2-48531007.pdf?src-supplier=Avnet; ComponentLink2Description: https://datasheet.ciiva.com/48531/aoa0000ce2-48531007.pdf?src-supplier=Avnet; ComponentLink3URL: https://datasheet.ciiva.com/30250/aoa0000ce2-30250862.pdf?src-supplier=Onlinecomponents.com; ComponentLink3Description: https://datasheet.ciiva.com/30250/aoa0000ce2-30250862.pdf?src-supplier=Onlinecomponents.com; ComponentLink4URL: https://datasheet.ciiva.com/16778/70260748-16778478.pdf?src-supplier=Allied+Electronics; ComponentLink4Description: https://datasheet.ciiva.com/16778/70260748-16778478.pdf?src-supplier=Allied+Electronics; ComponentLink5URL: https://datasheet.ciiva.com/16781/70260748-16781237.pdf?src-supplier=Allied+Electronics; ComponentLink5Description: https://datasheet.ciiva.com/16781/70260748-16781237.pdf?src-supplier=Allied+Electronics; ComponentLink6URL: https://datasheet.ciiva.com/22673/1678782-22673288.pdf?src-supplier=Element14; ComponentLink6Description: https://datasheet.ciiva.com/22673/1678782-22673288.pdf?src-supplier=Element14; ComponentLink7URL: https://datasheet.ciiva.com/24026/aoa0000ce2-24026635.pdf?src-supplier=Mouser; ComponentLink7Description: https://datasheet.ciiva.com/24026/aoa0000ce2-24026635.pdf?src-supplier=Mouser; ComponentLink8URL: https://datasheet.ciiva.com/22687/1678782-22687390.pdf?src-supplier=Element14; ComponentLink8Description: https://datasheet.ciiva.com/22687/1678782-22687390.pdf?src-supplier=Element14; ComponentLink9URL: https://datasheet.ciiva.com/7836/aoa0000ce2-7836503.pdf?src-supplier=Element14; ComponentLink9Description: https://datasheet.ciiva.com/7836/aoa0000ce2-7836503.pdf?src-supplier=Element14; ComponentLink10URL: https://datasheet.ciiva.com/7836/426256-7836821.pdf?src-supplier=Element14; ComponentLink10Description: https://datasheet.ciiva.com/7836/426256-7836821.pdf?src-supplier=Element14
R128 = ERJ-3GEYJ104V: 100K Ohm 5%  Res Thick Film 0603 1/10W +/-200ppm/ßC Molded SMD Punched Carrier T/R; Manufacturer_Name: Panasonic; Value: 100kR; Power Rating: 100mW; Voltage Rating: 75V; Temperature Coefficient: 200ppm/°C; Voltage Rating (DC): 50V; Datasheet Link: http://docs-europe.electrocomponents.com/webdocs/13ba/0900766b813ba21b.pdf; Height: 0.55mm; Manufacturer_Part_Number: ERJ-3GEYJ104V; Mouser Part Number: 667-ERJ-3GEYJ104V; Mouser Price/Stock: https://www.mouser.co.uk/ProductDetail/Panasonic/ERJ-3GEYJ104V?qs=66DK8nO8gJC7IhSuep78kw%3D%3D; Arrow Part Number: ERJ-3GEYJ104V; Arrow Price/Stock: https://www.arrow.com/en/products/erj-3geyj104v/panasonic?region=nac; Supplier: Digikey; Supplier Part Number: P100KGCT-ND; Manufacturer: Panasonic; Manufacturer Part Number: ERJ-3GEYJ104V; RoHS: Yes; Category: Chip SMD Resistors; Stock: 248896; Pricing: 1=0.1, 10=0.033, 50=0.02, 100=0.0165, 500=0.01096, 1000=0.00939 (USD); Mounting Technology: Surface Mount; Case/Package: 0603; Case Code (Imperial): 0603; Case Code (Metric): 1608; Weight: 7.1E-05oz; Contact Plating: Tin; Min Operating Temperature: -55°C; Max Operating Temperature: 155°C; Tolerance: 5%; Packaging: Tape and Reel; Package Quantity: 1; Resistor Type: Thick Film; Termination: SMD/SMT; Number of Terminations: 2; Max Power Dissipation: 100mW; Features: Automotive AEC-Q200; Series: ERJ; Construction: Rectangular; Resistance Tolerance: 5%; Technology: THICK FILM; Length: 1.6mm; Width: 0.8mm; Depth: 0.8mm; Reach SVHC Compliant: No; Military Standard: Not; RoHS Compliant: Yes; ComponentLink1URL: https://datasheet.ciiva.com/11809/0900766b80f806dd-11809567.pdf?src-supplier=Rs; ComponentLink1Description: https://datasheet.ciiva.com/11809/0900766b80f806dd-11809567.pdf?src-supplier=Rs; ComponentLink2URL: https://datasheet.ciiva.com/22758/1678796-22758220.pdf?src-supplier=Farnell; ComponentLink2Description: https://datasheet.ciiva.com/22758/1678796-22758220.pdf?src-supplier=Farnell; ComponentLink3URL: https://datasheet.ciiva.com/43460/1678796-43460761.pdf?src-supplier=Farnell; ComponentLink3Description: https://datasheet.ciiva.com/43460/1678796-43460761.pdf?src-supplier=Farnell; ComponentLink4URL: https://datasheet.ciiva.com/24159/aoa0000ce1-37422-24159717.pdf?src-supplier=Mouser; ComponentLink4Description: https://datasheet.ciiva.com/24159/aoa0000ce1-37422-24159717.pdf?src-supplier=Mouser; ComponentLink5URL: https://datasheet.ciiva.com/46380/1678796-46380412.pdf?src-supplier=Element14; ComponentLink5Description: https://datasheet.ciiva.com/46380/1678796-46380412.pdf?src-supplier=Element14; ComponentLink6URL: https://datasheet.ciiva.com/46389/1678796-46389629.pdf?src-supplier=Element14; ComponentLink6Description: https://datasheet.ciiva.com/46389/1678796-46389629.pdf?src-supplier=Element14; ComponentLink7URL: https://datasheet.ciiva.com/27055/1988495-27055706.pdf?src-supplier=Jameco; ComponentLink7Description: https://datasheet.ciiva.com/27055/1988495-27055706.pdf?src-supplier=Jameco; ComponentLink8URL: https://datasheet.ciiva.com/16762/70255313-16762591.pdf?src-supplier=Allied+Electronics; ComponentLink8Description: https://datasheet.ciiva.com/16762/70255313-16762591.pdf?src-supplier=Allied+Electronics; ComponentLink9URL: https://datasheet.ciiva.com/16508/aoa0000ce1-16508383.pdf?src-supplier=Future+Electronics; ComponentLink9Description: https://datasheet.ciiva.com/16508/aoa0000ce1-16508383.pdf?src-supplier=Future+Electronics
R135 R136 = ERJ-3EKF1000V: 100 Ohm 1% 1/10W 0603 ±100ppm/°C Molded SMD Punched Carrier T/R; Manufacturer_Name: Panasonic; Power Rating: 100mW; Voltage Rating: 75V; Datasheet Link: http://industrial.panasonic.com/cdbs/www-data/pdf/RDA0000/AOA0000C86.pdf; Height: 0.55mm; Manufacturer_Part_Number: ERJ-3EKF1000V; Mouser Part Number: 667-ERJ-3EKF1000V; Mouser Price/Stock: https://www.mouser.co.uk/ProductDetail/Panasonic/ERJ-3EKF1000V?qs=H7k1u0Mp9JS7i8KGO5m47A%3D%3D; Arrow Part Number: ERJ-3EKF1000V; Arrow Price/Stock: https://www.arrow.com/en/products/erj-3ekf1000v/panasonic?utm_currency=USD&region=nac; Supplier: Digikey; Supplier Part Number: P100HCT-ND; Manufacturer: Panasonic; Manufacturer Part Number: ERJ-3EKF1000V; RoHS: Yes; Category: Chip SMD Resistors; Stock: 1036225; Pricing: 1=0.1, 10=0.035, 100=0.0177, 1000=0.01014, 2500=0.00888 (USD); Mounting Technology: Surface Mount; Case/Package: 0603; Contact Plating: Tin; Case Code (Imperial): 0603; Case Code (Metric): 1608; Weight: 7.1E-05oz; Min Operating Temperature: -55°C; Max Operating Temperature: 155°C; Packaging: Tape and Reel; Package Quantity: 5000; Termination: SMD/SMT; Series: ERJ; Value: 100R; Tolerance: 1%; Resistor Type: Thick Film; Number of Terminations: 2; Temperature Coefficient: 100ppm/°C; Max Power Dissipation: 100mW; Voltage Rating (DC): 75V; Features: Automotive AEC-Q200; Resistance Tolerance: 1%; Construction: Rectangular; Length: 1.6mm; Width: 0.8mm; Depth: 0.8mm; Radiation Hardening: No; Reach SVHC Compliant: No; Lead Free: Lead Free; RoHS Compliant: Yes; Military Standard: Not; ComponentLink1URL: https://datasheet.ciiva.com/34303/1987450-34303565.pdf?src-supplier=Jameco; ComponentLink1Description: https://datasheet.ciiva.com/34303/1987450-34303565.pdf?src-supplier=Jameco; ComponentLink2URL: https://datasheet.ciiva.com/9186/aoa0000ce2-9186725.pdf?src-supplier=Avnet; ComponentLink2Description: https://datasheet.ciiva.com/9186/aoa0000ce2-9186725.pdf?src-supplier=Avnet; ComponentLink3URL: https://datasheet.ciiva.com/48530/aoa0000ce2-48530986.pdf?src-supplier=Avnet; ComponentLink3Description: https://datasheet.ciiva.com/48530/aoa0000ce2-48530986.pdf?src-supplier=Avnet; ComponentLink4URL: https://datasheet.ciiva.com/7830/aoa0000ce2-7830728.pdf?src-supplier=Element14; ComponentLink4Description: https://datasheet.ciiva.com/7830/aoa0000ce2-7830728.pdf?src-supplier=Element14; ComponentLink5URL: https://datasheet.ciiva.com/22667/1678782-22667887.pdf?src-supplier=Element14; ComponentLink5Description: https://datasheet.ciiva.com/22667/1678782-22667887.pdf?src-supplier=Element14; ComponentLink6URL: https://datasheet.ciiva.com/46372/1678782-46372726.pdf?src-supplier=Element14; ComponentLink6Description: https://datasheet.ciiva.com/46372/1678782-46372726.pdf?src-supplier=Element14; ComponentLink7URL: https://datasheet.ciiva.com/46372/1678782-46372727.pdf?src-supplier=Element14; ComponentLink7Description: https://datasheet.ciiva.com/46372/1678782-46372727.pdf?src-supplier=Element14; ComponentLink8URL: https://datasheet.ciiva.com/24159/aoa0000ce2-24159753.pdf?src-supplier=Mouser; ComponentLink8Description: https://datasheet.ciiva.com/24159/aoa0000ce2-24159753.pdf?src-supplier=Mouser; ComponentLink9URL: https://datasheet.ciiva.com/16765/70260748-16765766.pdf?src-supplier=Allied+Electronics; ComponentLink9Description: https://datasheet.ciiva.com/16765/70260748-16765766.pdf?src-supplier=Allied+Electronics; ComponentLink10URL: https://datasheet.ciiva.com/16762/70260748-16762666.pdf?src-supplier=Allied+Electronics; ComponentLink10Description: https://datasheet.ciiva.com/16762/70260748-16762666.pdf?src-supplier=Allied+Electronics; ComponentLink11URL: https://datasheet.ciiva.com/30088/aoa0000ce2-30088649.pdf?src-supplier=Onlinecomponents.com; ComponentLink11Description: https://datasheet.ciiva.com/30088/aoa0000ce2-30088649.pdf?src-supplier=Onlinecomponents.com
R138 = Resistor 2010: Resistor ISA-PLAN 2010 R015 1%; Manufacturer_Name: Vishay; Manufacturer_Part_Number: CRCW20100000Z0EFHP; Manufacturer: Isabellenhütte; Datasheet Link: http://www.vishay.com/docs/20043/crcwhpe3.pdf; Height: 0.7mm; Mouser Part Number: 71-CRCW20100000Z0EFH; Mouser Price/Stock: https://www.mouser.co.uk/ProductDetail/Vishay-Dale/CRCW20100000Z0EFHP?qs=k2%2FDWSARqgGSaNuPGbWcpw%3D%3D; Arrow Part Number: CRCW20100000Z0EFHP; Arrow Price/Stock: https://www.arrow.com/en/products/crcw20100000z0efhp/vishay?region=nac; Supplier: Digikey; Supplier Part Number: 4423-CMP-R015-1.0CT-ND; Manufacturer Part Number: CMP-R015-1.0; RoHS: No; Stock: 22462; Pricing: 1=1.6, 10=0.93, 25=0.7608, 50=0.6572, 100=0.5708, 250=0.47792, 500=0.42088, 1000=0.37312, 5000=0.3375 (USD)
R140 = ERJ-U03J106V: 10Mohm 5%  SMD 0603   Anti-Sulfur AEC-Q200; Manufacturer_Name: Panasonic; Value: 10MR; Power Rating: 100mW; Voltage Rating: 75V; Current Rating: 1A; Datasheet Link: http://industrial.panasonic.com/cdbs/www-data/pdf/RDP0000/AOA0000C334.pdf; Height: 0.55mm; Manufacturer_Part_Number: ERJ-U03J106V; Mouser Part Number: 667-ERJ-U03J106V; Mouser Price/Stock: https://www.mouser.co.uk/ProductDetail/Panasonic/ERJ-U03J106V?qs=pdFhdcvjjgjSJSqKhYCfQg%3D%3D; Supplier: Digikey; Supplier Part Number: 10-ERJ-U03J106VCT-ND; Manufacturer: Panasonic; Manufacturer Part Number: ERJ-U03J106V; RoHS: Yes; Category: Chip SMD Resistors; Stock: 15102; Pricing: 1=0.11, 10=0.053, 50=0.0336, 100=0.0282, 500=0.0197, 1000=0.01726 (USD); Case/Package: 0603; Case Code (Imperial): 0603; Case Code (Metric): 1608; Weight: 7.1E-05oz; Min Operating Temperature: -55°C; Max Operating Temperature: 155°C; Tolerance: 5%; Packaging: Tape and Reel; Package Quantity: 5000; Termination: SMD/SMT; Series: ERJ-U03; Length: 1.6mm; Width: 0.8mm; ComponentLink1URL: https://datasheet.ciiva.com/24170/ras-erj-u-267552-24170485.pdf?src-supplier=Mouser; ComponentLink1Description: https://datasheet.ciiva.com/24170/ras-erj-u-267552-24170485.pdf?src-supplier=Mouser
R141 = ERJ-3GEYJ305V: 3M Ohm 5% 1/10W Res Thick Film 0603 -400ppm/ to 150ppm|||| Molded SMD Punched Carrier T/R; Manufacturer_Name: Panasonic; Value: 3MR; Power Rating: 100mW; Voltage Rating: 75V; Temperature Coefficient: 150ppm/°C; Datasheet Link: http://docs-europe.electrocomponents.com/webdocs/13ba/0900766b813ba21b.pdf; Height: 0.55mm; Manufacturer_Part_Number: ERJ-3GEYJ305V; Mouser Part Number: 667-ERJ-3GEYJ305V; Supplier: Digikey; Supplier Part Number: P3.0MGCT-ND; Manufacturer: Panasonic; Manufacturer Part Number: ERJ-3GEYJ305V; RoHS: Yes; Category: Chip SMD Resistors; Stock: 29466; Pricing: 1=0.1, 10=0.033, 50=0.0202, 100=0.0166, 500=0.01102, 1000=0.00944 (USD); Mounting Technology: Surface Mount; Case/Package: 0603; Case Code (Metric): 1608; Case Code (Imperial): 0603; Weight: 7.1E-05oz; Contact Plating: Tin; Min Operating Temperature: -55°C; Max Operating Temperature: 155°C; Tolerance: 5%; Packaging: Tape and Reel; Package Quantity: 1; Resistor Type: Thick Film; Number of Terminations: 2; Termination: SMD/SMT; Max Power Dissipation: 100mW; Features: Automotive AEC-Q200; Series: ERJ; Resistance Tolerance: 5%; Technology: THICK FILM; Construction: Rectangular; Length: 1.6mm; Width: 0.8mm; Depth: 0.8mm; Reach SVHC Compliant: No; Military Standard: Not; RoHS Compliant: Yes; ComponentLink1URL: https://datasheet.ciiva.com/43460/1500035-43460793.pdf?src-supplier=Farnell; ComponentLink1Description: https://datasheet.ciiva.com/43460/1500035-43460793.pdf?src-supplier=Farnell; ComponentLink2URL: https://datasheet.ciiva.com/24124/aoa0000ce1-37422-24124297.pdf?src-supplier=Mouser; ComponentLink2Description: https://datasheet.ciiva.com/24124/aoa0000ce1-37422-24124297.pdf?src-supplier=Mouser; ComponentLink3URL: https://datasheet.ciiva.com/46377/1500035-46377147.pdf?src-supplier=Element14; ComponentLink3Description: https://datasheet.ciiva.com/46377/1500035-46377147.pdf?src-supplier=Element14; ComponentLink4URL: https://datasheet.ciiva.com/30248/4aoa0000ce1-30248491.pdf?src-supplier=Onlinecomponents.com; ComponentLink4Description: https://datasheet.ciiva.com/30248/4aoa0000ce1-30248491.pdf?src-supplier=Onlinecomponents.com; ComponentLink5URL: https://datasheet.ciiva.com/28693/1678796-28693385.pdf?src-supplier=Element14; ComponentLink5Description: https://datasheet.ciiva.com/28693/1678796-28693385.pdf?src-supplier=Element14; ComponentLink6URL: https://datasheet.ciiva.com/16767/70255313-16767708.pdf?src-supplier=Allied+Electronics; ComponentLink6Description: https://datasheet.ciiva.com/16767/70255313-16767708.pdf?src-supplier=Allied+Electronics; ComponentLink7URL: https://datasheet.ciiva.com/16788/70255313-16788695.pdf?src-supplier=Allied+Electronics; ComponentLink7Description: https://datasheet.ciiva.com/16788/70255313-16788695.pdf?src-supplier=Allied+Electronics